# EAGLE schematic sensor (EAGLE 6.3)
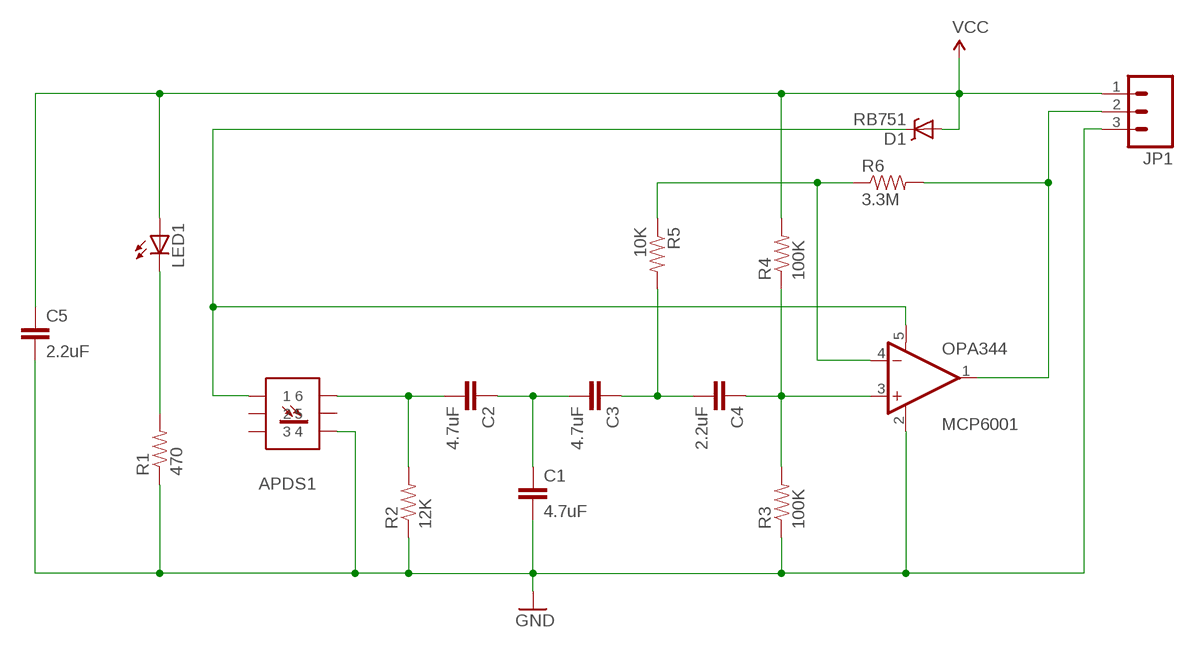
[diagram p0: schematic, sheet 1]

## Parts
APDS1  APDS-9008  [MINIATURE-CHIPLED]
C1  4.7uF  1.0UF-16V-10%(0603)  [0603-CAP]
C2  4.7uF  1.0UF-16V-10%(0603)  [0603-CAP]
C3  4.7uF  1.0UF-16V-10%(0603)  [0603-CAP]
C4  2.2uF  1.0UF-16V-10%(0603)  [0603-CAP]
C5  2.2uF  1.0UF-16V-10%(0603)  [0603-CAP]
D1  RB751  [SOD-523]
JP1  M03LONGPADS  [1X03_LONGPADS]
LED1  LED0603  [LED-0603]
MCP6001  OPA344  [SOT23-5]
R1  470  10KOHM1/10W1%(0603)0603  [0603-RES]
R2  12K  10KOHM1/10W1%(0603)0603  [0603-RES]
R3  100K  10KOHM1/10W1%(0603)0603  [0603-RES]
R4  100K  10KOHM1/10W1%(0603)0603  [0603-RES]
R5  10K  10KOHM1/10W1%(0603)0603  [0603-RES]
R6  3.3M  10KOHM1/10W1%(0603)0603  [0603-RES]

## Nets
GND: APDS1.P$4 C1.2 C5.2 JP1.3 MCP6001.2(V-) R1.1 R2.1 R3.1
N$3: LED1.C R1.2
N$6: MCP6001.4(-IN) R5.1 R6.1
N$7: APDS1.P$6 C2.2 R2.2
N$8: C1.1 C2.1 C3.2
N$9: C3.1 C4.2 R5.2
N$10: C4.1 MCP6001.3(+IN) R3.2 R4.1
OUT: JP1.2 MCP6001.1(OUT) R6.2
VCC: C5.1 D1.A JP1.1 LED1.A R4.2
VDD: APDS1.P$1 D1.C MCP6001.5(V+)
Unconnected: APDS1.P$2 APDS1.P$3 APDS1.P$5

## Library data of the parts
APDS1 = librae:APDS-9008: Miniature Surface-Mount Ambient Light Photo Sensor
C1-C5 = SparkFun-Capacitors:1.0UF-16V-10%(0603): CAP-00868; PROD_ID: CAP-00868; VALUE: 1.0uF
D1 = SparkFun-DiscreteSemi:RB751: 40V 120mA SOD-523 Schottky DIO-11018; PROD_ID: DIO-11018
JP1 = SparkFun-Connectors:M03: Header 3 Standard 3-pin 0.1" header. Use with straight break away headers (SKU : PRT-00116), right angle break away headers (PRT-00553), swiss pins (PRT-00743), machine pins (PRT-00117), and female headers (PRT-00115). Molex polarized connector foot print use with SKU : PRT-08232 with associated crimp pins and housings.
LED1 = SparkFun-LED:LED: LEDs Standard schematic elements and footprints for 5mm, 3mm, 1206, and 0603 sized LEDs. 5mm - Spark Fun Electronics SKU : COM-00529 (and others)
MCP6001 = SparkFun-AnalogIC:OPA344: Single gate rail-to-rail output op-amp. Inputs extend 300mV past rails.
R1-R4 R6 = SparkFun-Resistors:10KOHM1/10W1%(0603): RES-00824; PROD_ID: RES-00824; VALUE: 10K
R5 = SparkFun-Resistors:10KOHM1/10W1%(0603): RES-00824; PROD_ID: RES-00824